# EAGLE design soil-moisture-sensor (EAGLE 5.08)
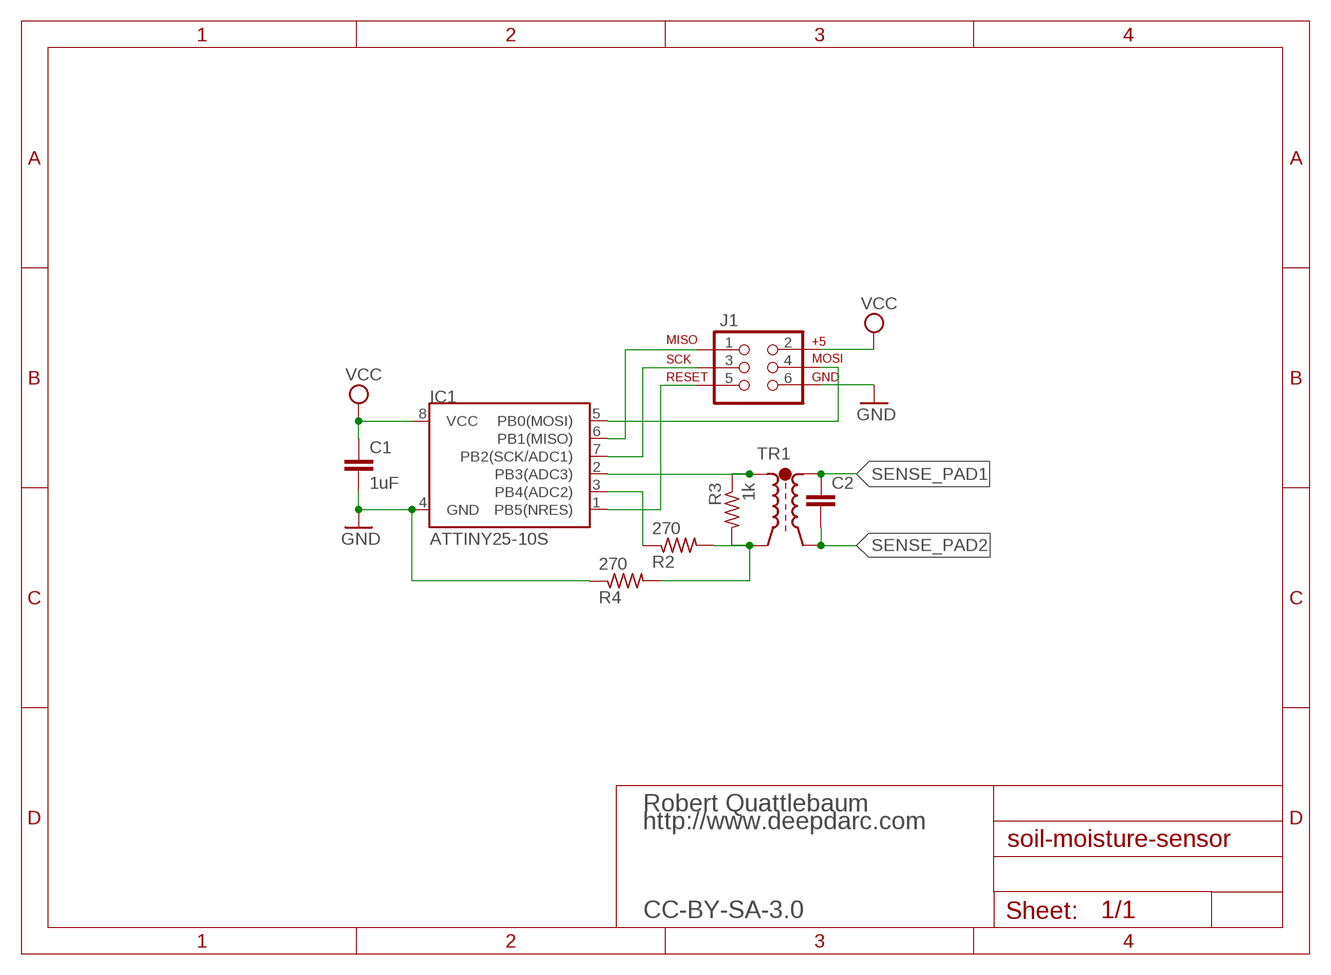
[diagram p0: schematic, sheet 1]

## Parts
C1  1uF  C-EUC0805  [C0805]
C2  C-EUC0805  [C0805]
IC1  ATTINY25-10S  ATTINY13-10S  [SO08-EIAJ]
J1  AVR_SPI_PRG_6NS  [2X3-NS]
R2  270  R-US_M0805  [M0805]
R3  1k  R-US_M0805  [M0805]
R4  270  R-US_M0805  [M0805]
TR1  SRF0703  [SRF0703]

## Nets
!RESET: IC1.1(PB5(NRES)) J1.5
GND: C1.2 IC1.4(GND) J1.6 R4.1
MISO: IC1.6(PB1(MISO)) J1.1
MOSI: IC1.5(PB0(MOSI)) J1.4
N$1: R2.2 R3.2 R4.2 TR1.3
N$2: IC1.3(PB4(ADC2)) R2.1
N$6: IC1.2(PB3(ADC3)) R3.1 TR1.1
SCK: IC1.7(PB2(SCK/ADC1)) J1.3
SENSE_PAD1: C2.1 TR1.2
SENSE_PAD2: C2.2 TR1.4
VCC: C1.1 IC1.8(VCC) J1.2

## Notes on the sheet
- Robert Quattlebaum
- http://www.deepdarc.com
- CC-BY-SA-3.0

## Library data of the parts
C1 C2 = 0common:C-EU: CAPACITOR, European symbol
IC1 = SparkFun:ATTINY13
J1 = SparkFun:AVR_SPI_PRG_6: AVR ISP 6 Pin This is the reduced ISP connector for AVR programming. Common on Arduino. This footprint will take up less PCB space and can be used with a 10-pin to 6-pin adapter such as SKU: BOB-08508
R2-R4 = 0common:R-US_: RESISTOR, American symbol
TR1 = 0-common:SRF0703: TRANSFORMER SMD transformer

## Board
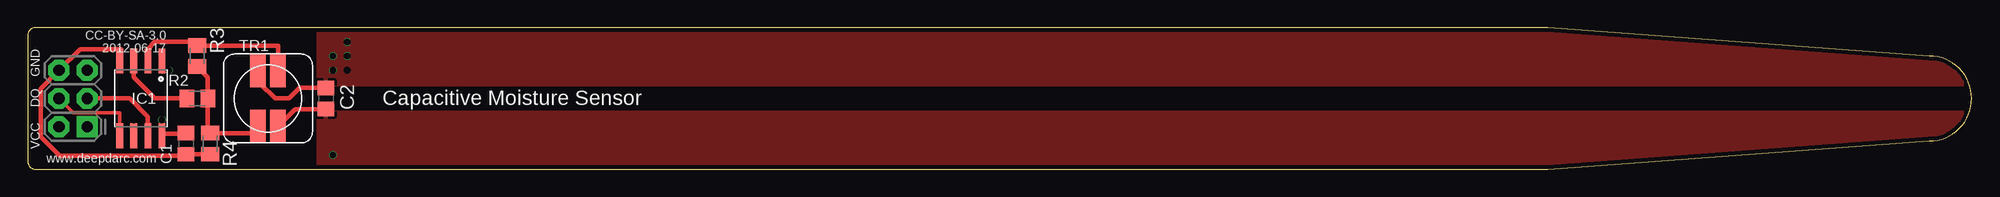
[diagram p1: board, top side]
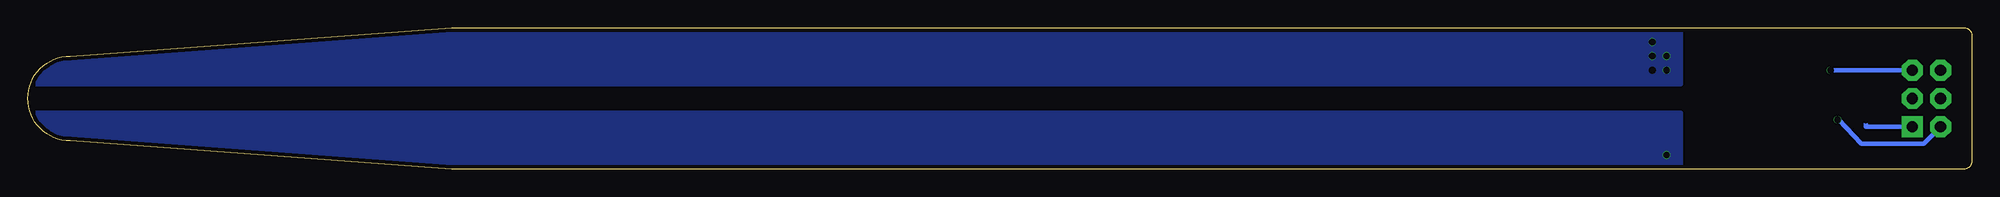
[diagram p2: board, bottom side, seen from below]

Size 174.75 x 12.7 mm. Coordinates in mm from the lower left corner, seen from the top.
Outline: 136.65,0 170.94,2.54 arc180 170.94,10.16 136.65,12.7 0.64,12.7 arc90 0,12.07 0,0.64 arc90 0.76,0 136.65,0
Copper layers (1*16): Top 0.035mm / dielectric 1.5mm / Bottom 0.035mm
Design rules "default *": minimum track width 10mil, minimum drill 15mil, track to track 8mil, track to pad 7.5mil, pad to pad 7.5mil, via to via 8mil, smd to smd 5mil, copper to edge 15mil, drill to drill 8mil, minimum pad ring 10mil, minimum via ring 1mil, stop-mask expansion 4mil, vias tented up to drill 0mil, thermal gap 10mil

### Footprints (pad centres in the part's own frame; a part is rotated, then mirrored left to right if it is on the bottom)
C0805 = smd 1.3 x 1.5: 1 -0.95,0; 2 0.95,0
SO08-EIAJ = smd 0.61 x 2.21: 1 -1.905,-3.378; 2 -0.635,-3.378; 3 0.635,-3.378; 4 1.905,-3.378; 5 1.905,3.353; 6 0.635,3.353; 7 -0.635,3.353; 8 -1.905,3.353
2X3-NS = drill 1.016 pad 1.88 square: 1 -2.54,-1.27 | drill 1.016 pad 1.88 octagon: 2 -2.54,1.27; 3 0,-1.27; 4 0,1.27; 5 2.54,-1.27; 6 2.54,1.27
M0805 = smd 1.3 x 1.6: 1 -0.95,0; 2 0.95,0
SRF0703 = smd 1.397 x 2.997: 1 0.9,2.5; 2 -0.9,2.5; 3 -0.9,-2.5; 4 0.9,-2.5

### Placement (x,y rotation side)
C1  14.22,2.29 270 top
C2  26.8,6.35 270 top
IC1  10.16,6.35 180 top
J1  4.06,6.35 90 top
R2  15.24,6.35 0 top
R3  15.24,10.16 270 top
R4  16.38,2.29 90 top
TR1  21.59,6.35 0 top

### Tracks (layer width: path | path; a pad name or v marks a point on that pad's centre or on a via)
!RESET  (via drill 0.6)
  Top 0.406: v12.7,8.89 12.06,8.77 IC1.1
  Bottom 0.406: J1.5 v12.7,8.89
GND
  Top 0.406: 7.11,10.8 4.7,10.8 J1.6 1.14,7.24 1.14,2.92 2.85,1.21 14.29,1.21 14.22,1.27 C1.2 | 7.11,10.8 8.38,10.8 8.38,10.37 IC1.4 | C1.2 14.29,1.27 | 7.11,10.8 7.11,10.84 | C1.2 R4.1
MISO  (via drill 0.6)
  Top 0.406: v9.53,4.45 IC1.6
  Bottom 0.406: J1.1 9.53,3.81 v9.53,4.45
MOSI
  Top 0.305: IC1.5 8.26,5.08 4.06,5.08 J1.4
N$1
  Top 0.406: R3.2 16.19,8.26 R2.2 16.19,3.24 R4.2 20.08,3.24 TR1.3
N$2
  Top 0.406: R2.1 11.43,6.35 9.53,8.26 IC1.3
N$6
  Top 0.406: TR1.1 22.49,11.11 R3.1 14.92,11.43 11.43,11.43 10.79,10.8 IC1.2
SCK
  Top 0.406: J1.3 9.14,6.35 10.79,4.7 IC1.7
SENSE_PAD1  (via drill 0.6)
  Top 0.406: TR1.2 20.95,8.59 20.95,7.62 22.23,6.35 23.5,6.35 24.45,7.3 C2.1
  other vias: 27.43,10.16 28.7,11.43 28.7,8.89 27.43,8.89 28.7,10.16
  pour Top: 26.16,12.7 177.16,12.7 177.16,7.62 26.16,7.62
  pour Bottom: 26.16,12.7 177.16,12.7 177.16,7.62 26.16,7.62
SENSE_PAD2  (via drill 0.6)
  Top 0.406: TR1.4 24.04,5.4 C2.2
  other vias: 27.43,1.27
  pour Top: 26.16,5.08 177.16,5.08 177.16,0 26.16,0
  pour Bottom: 26.16,5.08 177.16,5.08 177.16,0 26.16,0
VCC  (via drill 0.6)
  Top 0.406: C1.1 14.16,3.18 12.06,3.18 IC1.8 v12.06,4.45
  Bottom 0.406: J1.2 4.32,2.29 9.91,2.29 11.94,4.45 v12.06,4.45

### Text on the board
tNames: CC-BY-SA-3.0 | GND | 2012-06-17 | DQ | Capacitive Moisture Sensor | VCC | www.deepdarc.com